# Altium schematic sheet DIGLITE.SchDoc: DigiRig Lite Plus
size A4; Engineer: CT; SheetNumber: 1; SheetTotal: 3
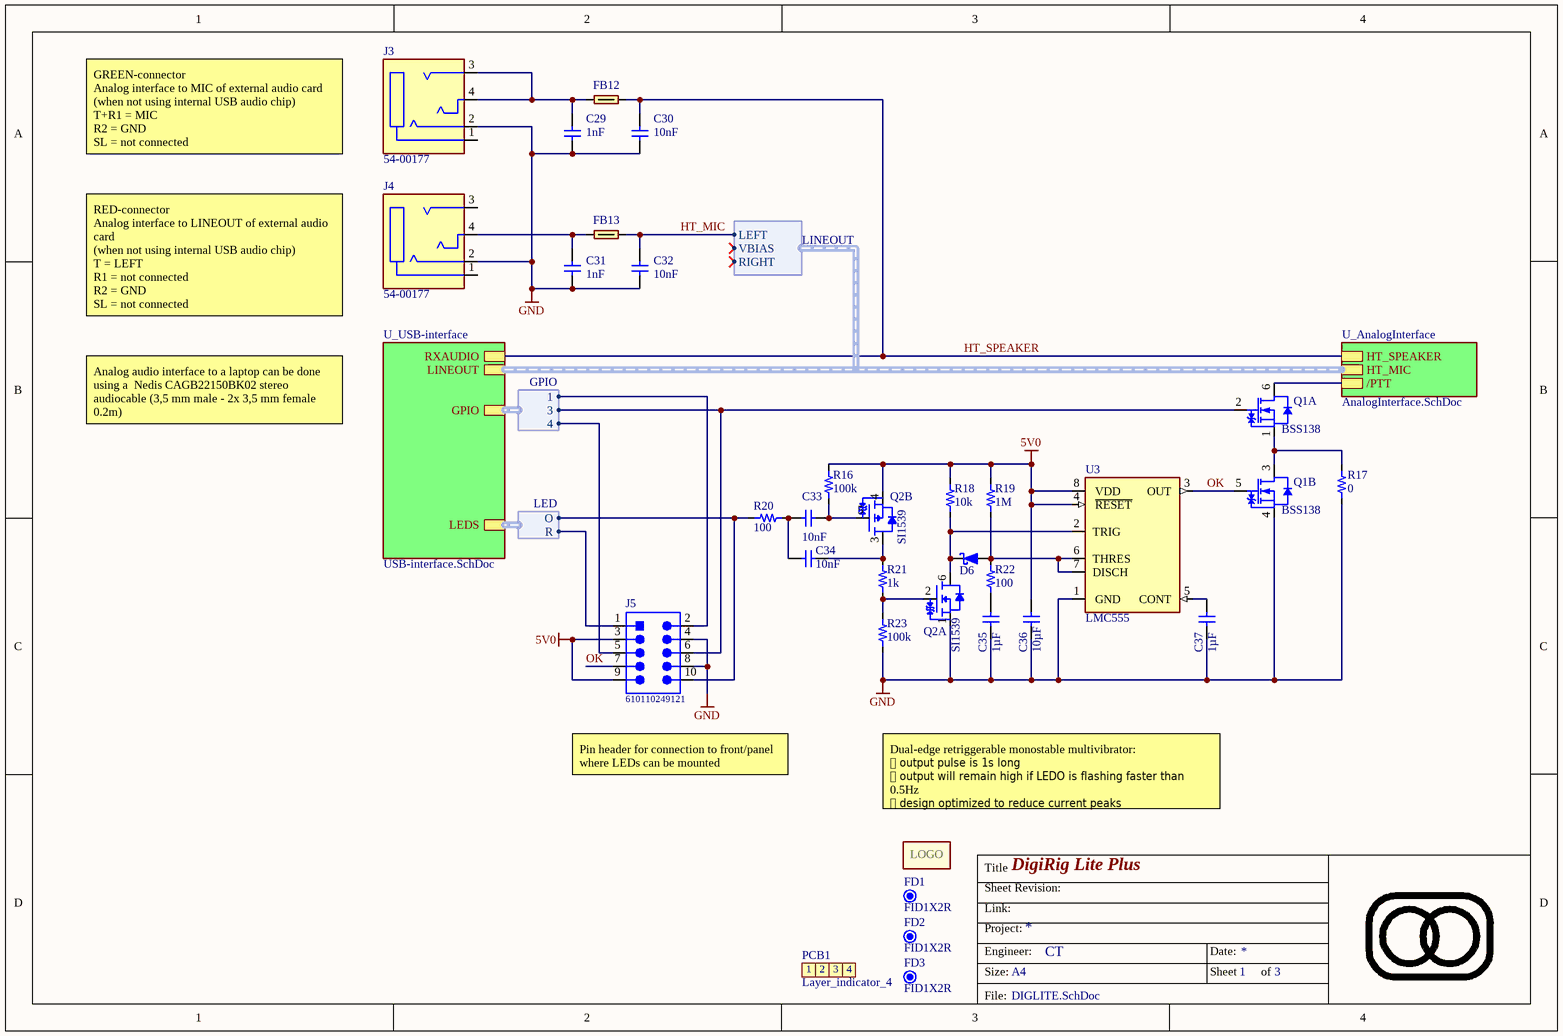
[diagram p0: DIGLITE.SchDoc]

## Parts
C29  value 1nF  [0603-C-N]  (hidden comment: Capacitor 1 nF +/-5% 50V C0G 0603)
C30  value 10nF  [0603-C-N]  (hidden comment: Capacitor 10nF 50V NP0 0603)
C31  value 1nF  [0603-C-N]  (hidden comment: Capacitor 1 nF +/-5% 50V C0G 0603)
C32  value 10nF  [0603-C-N]  (hidden comment: Capacitor 10nF 50V NP0 0603)
C33  value 10nF  [0603-C-N]  (hidden comment: Capacitor 10nF 50V NP0 0603)
C34  value 10nF  [0603-C-N]  (hidden comment: Capacitor 10nF 50V NP0 0603)
C35  value 1µF  [0603-C-N]  (hidden comment: Capacitor 1µF +/-10% 16V X7R 0603)
C36  value 10µF  [WCAP-CSGP_1210_L3.2W2.5H2.5]  (hidden comment: Capacitor 10µF +/-10% 50V X7R 1210)
C37  value 1µF  [0603-C-N]  (hidden comment: Capacitor 1µF +/-10% 16V X7R 0603)
D6  RB521SM-30T2R  [FP-SOD523-MFG]  (value not drawn)
FB12  742792662  [0603-FB-N]  (value not drawn)
FB13  742792662  [0603-FB-N]  (value not drawn)
FD1  FID1X2R  [FID1X2R]  (no BOM)
FD2  FID1X2R  [FID1X2R]  (no BOM)
FD3  FID1X2R  [FID1X2R]  (no BOM)
J3  54-00177  [54-00177-Footprint-1]
J4  54-00177  [54-00177-Footprint-1]
J5  610110249121  [610110249121]
M1  Logo  [LOGO_9x6mm]  (value not drawn)  (no BOM)
PCB1  Layer_indicator_4  [LayerId_4L_4x1.5mm]  (no BOM)
Q1  value BSS138  [SOT-363-N]  (hidden comment: BSS138PS.115)  (parts A,B of 2)
Q2  value SI1539  [SOT-363-N]  (hidden comment: SI1539CDL-T1-GE3)  (parts A,B of 2)
R16  value 100k  [0603-R-N]  (hidden comment: Resistor 100k +/-1% 50V 0603)
R17  value 0  [0603-R-N]  (hidden comment: Jumper 0R <50 mOhm 1A 0603)
R18  value 10k  [0603-R-N]  (hidden comment: Resistor 10k +/-1% 50V 0603)
R19  value 1M  [0603-R-N]  (hidden comment: Resistor 1M +/-1% 50V 0603)
R20  value 100  [0603-R-N]  (hidden comment: Resistor 100R +/-1% 50V 0603)
R21  value 1k  [0603-R-N]  (hidden comment: Resistor 1k +/-1% 50V 0603)
R22  value 100  [0603-R-N]  (hidden comment: Resistor 100R +/-1% 50V 0603)
R23  value 100k  [0603-R-N]  (hidden comment: Resistor 100k +/-1% 50V 0603)
U3  value LMC555  [VSSOP8]  (hidden comment: LMC555CMM/NOPB)

## Sub-sheets
U_AnalogInterface = AnalogInterface.SchDoc: /PTT, HT_SPEAKER, HT_MIC (harness LINEOUT)
U_USB-interface = USB-interface.SchDoc: RXAUDIO, LINEOUT (harness LINEOUT), LEDS (harness LED), GPIO (harness GPIO)

## Harnesses
LED: O, R
GPIO: 1, 3, 4
LINEOUT: LEFT, VBIAS, RIGHT

## Nets
5V0: C36.2 J5.3 J5.9 Q2.4(S) R16.2 R18.2 R19.2 U3.4(~{RESET}) U3.8(VDD)
GND: C29.2 C30.2 C31.2 C32.2 C35.1 C36.1 C37.1 J3.2 J4.2 J5.4 J5.8 Q1.4(S) Q2.1(S) R17.1 R23.1 U3.1(GND)
HT_MIC: C32.1 FB13.2 ; sheet U_USB-interface/LINEOUT.LEFT
HT_SPEAKER: C30.1 FB12.2 ; sheet U_USB-interface/RXAUDIO, sheet U_AnalogInterface/HT_SPEAKER
OK: J5.7 Q1.5(G) U3.3(OUT)
NetC29_1: C29.1 FB12.1 J3.3 J3.4
NetC31_1: C31.1 FB13.1 J4.4
NetC33_1: C33.1 C34.1 R20.1
NetC33_2: C33.2 Q2.5(G) R16.1
NetC34_2: C34.2 Q2.3(D) R21.1
NetC35_2: C35.2 R22.1
NetC37_2: C37.2 U3.5(CONT)
NetD6_1: D6.1(K) Q2.6(D) R18.1 U3.2(TRIG)
NetD6_2: D6.2(A) R19.1 R22.2 U3.6(THRES) U3.7(DISCH)
NetJ5_1: J5.1 ; sheet U_USB-interface/LEDS.R
NetJ5_2: J5.2 ; sheet U_USB-interface/GPIO.1
NetJ5_5: J5.5 ; sheet U_USB-interface/GPIO.4
NetJ5_6: J5.6 Q1.2(G) ; sheet U_USB-interface/GPIO.3
NetJ5_10: J5.10 R20.2 ; sheet U_USB-interface/LEDS.O
NetQ1_1: Q1.1(S) Q1.3(D) R17.2
NetQ1_6: Q1.6(D) ; sheet U_AnalogInterface//PTT
NetQ2_2: Q2.2(G) R21.2 R23.2

Not connected (* = marked no-connect by the designer): J3 1; J4 1 3

## Buses and harness runs
harness sheet U_AnalogInterface/HT_MIC = sheet U_USB-interface/LINEOUT

## Notes on the sheet
- GREEN-connector
  Analog interface to MIC of external audio card
  (when not using internal USB audio chip)
  T+R1 = MIC
  R2 = GND
  SL = not connected
- RED-connector
  Analog interface to LINEOUT of external audio card
  (when not using internal USB audio chip)
  T = LEFT
  R1 = not connected
  R2 = GND
  SL = not connected
- Analog audio interface to a laptop can be done using a  Nedis CAGB22150BK02 stereo audiocable (3,5 mm male - 2x 3,5 mm female 0.2m)
- Pin header for connection to front/panel
  where LEDs can be mounted
- Dual-edge retriggerable monostable multivibrator:
  ⦿ output pulse is 1s long
  ⦿ output will remain high if LEDO is flashing faster than 0.5Hz
  ⦿ design optimized to reduce current peaks
- Title
- Sheet Revision:
- Link:
- Size:
- Project:
- Engineer:
- A4
- Date:
- Sheet
- of
- File:
- (in symbol CMP-000006-6) 1; 2; 3; 4
- (in symbol Logo) LOGO

## Library data of the parts
C29 C31 = CMP-001-00112-14: Capacitor MLCC, General Purpose, size 0603, C0G, 1 nF, +/-5%, 50V; Page Part #: CCQK102T2; Tolerance: 5%; Case/Package: 0603; Width: 0.8mm; Min Operating Temperature: -55°C; Mounting Technology: SMT; Dielectric: C0G; Packaging: Cut Tape; Max Operating Temperature: 125°C; Voltage Rating: 50V; Height: 0.8mm; Length: 1.6mm; JLCPCB Part #: C340644; REACH SVHC: Unknown; Capacitor Type: MLCC; Usage: General Purpose; Pins: 2
C30 C32-C34 = CMP-001-00137-7: Multilayer Ceramic Capacitor, Grm Series, 0.01 F, 5%, C0g / Np0, 50 V, 0603 [1608 Metric]; FLIR Part #: YCAM10N-7; Page Part #: CCQJ103T; Temperature Coefficient: 30ppm/°C; Reach SVHC Compliant: No; Case/Package: 0603; Thickness: 0.035inch; Width: 0.8mm; Case Code (Metric): 1608; Termination: SMD/SMT; Min Operating Temperature: -55°C; Voltage Rating (DC): 50V; Mounting Technology: Surface Mount; Package Quantity: 4000; Depth: 0.8mm; Dielectric: C0G; Packaging: Cut Tape; Voltage: 50V; Max Operating Temperature: 125°C; RoHS Compliant: Yes; Material: Ceramic; Lead Pitch: 0.5mm; Case Code (Imperial): 0603; Tolerance: 5%; Voltage Rating: 50V; Lead Free: Lead Free; Height: 0.8mm; Length: 1.6mm; JLCPCB Part #: C85973; Series: GRM
C35 C37 = CMP-001-00004-22: Capacitor MLCC, General Purpose, size 0603, X7R, 1µF, +/-10%, 16V; Tolerance: 10%; Mounting Technology: SMT; Usage: General Purpose; Case/Package: 0603; Max Operating Temperature: 125°C; JLCPCB Part #: C15849; Dielectric: X7R; RoHS Compliant: True; Height: 0.8mm; Width: 0.8mm; Capacitor Type: MLCC; Voltage Rating: 16V; Length: 1.6mm; Pins: 2; Min Operating Temperature: -55°C
C36 = CMP-072-000922-16: WCAP-CSGP Multilayer Ceramic Chip Capacitor, General Purpose, size 1210, X7R, 10µF, 50VDC; Tolerance: 10%; Technical Reference: X7R1210106K050DFCT10000; Insulation Resistance: 0.01GO; Capacitor Type: MLCC; ComponentLink2URL: https://www.we-online.com/redexpert/spec/885012209073?ad; ComponentLink1URL: https://www.we-online.com/redexpert/article/885012209073?ad; Source: WCAP-CSGP.SchLib; Case/Package: 1210; Packaging: Tape and Reel; ComponentLink1Description: Website Link; Pins: 2; Width: 2.5mm; Voltage Rating: 50V; ComponentLink2Description: Datasheet Link; Match Code: WCAP-CSGP; Max Operating Temperature: 125°C; Usage: General Purpose; JLCPCB Part #: C77102; Height: 2.5mm; Dielectric: X7R; Dissipation Factor: 10%; Length: 3.2mm; Min Operating Temperature: -55°C; Design Item ID: 885012209073; Mounting Technology: SMT
D6 = CMP-004-00062-1: RB521SM Series 30 V 200 mA Surface Mount Schottky Barrier Diode -SOD-523 (SC-79); Forward Voltage: 470mV; Forward Current: 200mA; Max Repetitive Reverse Voltage (Vrrm): 30V; Max Forward Surge Current (Ifsm): 1A; Element Configuration: Single; Number of Elements: 1; Peak Reverse Current: 30µA; JLCPCB Part #: C727120; Case/Package: SOD-523-2; Packaging: Tape & Reel; Radiation Hardening: No; Max Reverse Voltage (DC): 30V; Width: 800µm; Number of Terminals: 2; Min Operating Temperature: -40°C; Average Rectified Current: 200mA; REACH SVHC: Yes; Max Operating Temperature: 150°C; RoHS: Compliant; Pins: 2; Length: 1.2mm; Peak Non-Repetitive Surge Current: 1A; Lead Free: Lead Free; Reverse Standoff Voltage: 30V; Mounting Technology: Surface Mount; Max Output current: 200mA; Height: 600µm; Lifecycle Status: Production; Weight: 992.233309µg
FB12 FB13 = CMP-066-000126-8: WE-CBF SMT EMI Suppression Ferrite Bead, size 0603, 1000O, 0.83A; Manufacturer: Wurth Elektronik; Page Part #: FILTER279; Case/Size Code: 0603; Impedance Max Test Condition: 120MHz; Type: Wide Band; DC Resistance Max: 0.3O; Impedance Max: 1050O; Rated Current: 0.6A; Mount: Surface Mount; Impedance @100MHz: 1000O; JLCPCB Part #: C180490; ComponentLink1URL: https://www.we-online.com/redexpert/article/742792662?ad; ComponentLink2URL: https://www.we-online.com/redexpert/spec/742792662?ad; Length: 1.6mm; ComponentLink1Description: Website Link; Manufacturer Part Number: 742792662; Width: 0.8mm; Match Code: WE-CBF; Component Type: Standard; Design Item ID: 742792662; Pin Count: 2; Operating Temperature Max: 125°C; Packaging: Tape and Reel; ComponentLink2Description: Datasheet Link; Operating Temperature Min: -55°C; Category: Ferrites for PCB Assembly; Height: 0.8mm
FD1-FD3 = CMP-00028-00005-14: Fiducial - Round 1x2mm; Pins: 0
J3 J4 = CMP-002-00136-2: Conn Jack 4 Cond 3.5MM SMD R/a; Shielding: Shielded; Body Color: Black; Gender: Female; Min Operating Temperature: -40°C; Termination: Solder; Mounting Technology: Surface Mount; JLCPCB Part #: C7507452; Max Operating Temperature: 105°C; Contact Plating: Gold; Contact Material: Bronze; Series: -
J5 = CMP-045-000083-5: WR-PHD Pin Header, SMT, pitch 2.54mm, Dual Row, Angled, 10p; Manufacturer: Wurth Elektronik; Rated Current: 3A; Working Voltage: 250VAC; Contact Resistance: 20mOhm; Pin Number: 10; Withstanding Voltage: 600VAC; Component Type: Standard; Packaging: Tape and Reel; ComponentLink1Description: Manufacturer; Operating Temperature: -40 to +105degC; ComponentLink1URL: http://www.we-online.de; Source: WR-PHD_Pin Header.SchLib; Design Item ID: 610110249121; Pitch: 2.54mm; ComponentLink2Description: Datasheet; ComponentLink2URL: https://www.we-online.com/catalog/datasheet/610110249121.pdf; Gender: Pin Header; Orientation: Angled; Row Number: Dual; Pin Count: 10; Manufacturer Part Number: 610110249121; Mounting Technology: SMT; JLCPCB Part #: C5149355
PCB1 = CMP-000006-6: Layer indicator for 4 layers
Q1 = CMP-013-00062-13: Transistor MOSFET Array Dual N-CH 60V 320mA 6-Pin TSSOP T/R; Page Part #: TBSS138PS; Transistor Type: NMOS, NMOS; Fall Time: 4ns; Input Capacitance: 50pF; Turn-On Delay Time: 2ns; Turn-Off Delay Time: 9ns; Gate to Source Voltage (Vgs): 20V; Power Dissipation: 280mW; Threshold Voltage: 1.2V; Rds On Max: 1.6R; Max Power Dissipation: 420mW; Rise Time: 3ns; Max Operating Temperature: 150°C; Drain to Source Voltage (Vdss): 60V; Max Dual Supply Voltage: 60V; JLCPCB Part #: C154900; Drain to Source Breakdown Voltage: 60V; Contact Plating: Tin; Min Operating Temperature: -55°C; Packaging: Tape and Reel; Case/Package: SOT-363; Continuous Drain Current (ID): 320mA; Radiation Hardening: No; Lead Free: Lead Free; RoHS Compliant: Yes; Drain to Source Resistance: 1.6R; Reach SVHC Compliant: Yes; Pins: 6
Q2 = CMP-142-000016-6: Trans Mosfet N/p-ch 30V 0.7A/0.4A 6-PIN SC-70 T/r / Mosfet N/p-ch 30V SOT363; Turn-On Delay Time: 32ns; Rise Time: 19ns; FET Type: N and P-Channel; Max Power Dissipation: 340mW; Drain to Source Resistance: 740mR; Threshold Voltage: 1.2V; Polarity: N-CHANNEL,P-CHANNEL; Continuous Drain Current (ID): 700mA; Rds On Max: 388mR; Fall Time: 10ns; Gate to Source Voltage (Vgs): 20V; Number of Channels: 2; Input Capacitance: 28pF; Turn-Off Delay Time: 4ns; Transistor Type: CMOS; Drain to Source Voltage (Vdss): 30V; JLCPCB Part #: C141530; Lead Free: Lead Free; Pins: 6; Series: TrenchFET®; Radiation Hardening: No; Case/Package: SOT-363; Packaging: Tape and Reel; Reach SVHC Compliant: No; Min Operating Temperature: -55°C; Weight: 0.000988oz; Mounting Technology: Surface Mount; Package Quantity: 3000; Max Operating Temperature: 150°C; RoHS Compliant: Yes
R16 R23 = CMP-009-00023-29: Chip Resistor, Thick Film, General Purpose, 0603, 100mW, 50V, 100 kOhm, +/-1%; Page Part #: ROQF1003; Tolerance: 1%; Elements: 1; Max Operating Temperature: 155°C; Usage: General Purpose; Mounting Technology: SMT; Voltage Rating: 50V; Power Rating: 100mW; Min Operating Temperature: -55°C; RoHS Compliant: Yes; Pins: 2; Resistor Type: Thick Film; JLCPCB Part #: C25803; Case/Package: 0603; JLCPCB Basic part: Yes
R17 = CMP-009-00006-27: Chip Jumper, Thick Film, Jumper, 0603, 100mW, 1A, 0 Ohm, <50 mOhm; FLIR Part #: YRES0E-1; Page Part #: ROQJ0000; Elements: 1; Tolerance: 50 mOhm; Voltage Rating: 75V; Min Operating Temperature: -55°C; RoHS Compliant: True; Usage: Jumper; Mounting Technology: SMT; Max Operating Temperature: 155°C; Case/Package: 0603; JLCPCB Part #: C21189; Current Rating: 1A; Resistor Type: Thick Film; Power Rating: 100mW; Pins: 2; JLCPCB Basic Part: Yes
R18 = CMP-009-00017-29: Chip Resistor, Thick Film, General Purpose, 0603, 100mW, 50V, 10 kOhm, +/-1%; FLIR Part #: YRES10K-1; Page Part #: ROQF1002; Elements: 1; Tolerance: 1%; Pins: 2; Resistor Type: Thick Film; Voltage Rating: 50V; Power Rating: 100mW; Mounting Technology: SMT; Min Operating Temperature: -55°C; Case/Package: 0603; RoHS Compliant: Yes; Usage: General Purpose; JLCPCB Part #: C25804; Max Operating Temperature: 155°C; JLCPCB Basic part: Yes
R19 = CMP-009-00234-18: Chip Resistor, Thick Film, General Purpose, 0603, 100mW, 50V, 1 MOhm, +/-1%; Tolerance: 1%; Elements: 1; RoHS Compliant: Yes; Mounting Technology: SMT; Max Operating Temperature: 155°C; Resistor Type: Thick Film; Usage: General Purpose; Voltage Rating: 50V; Min Operating Temperature: -55°C; Power Rating: 100mW; JLCPCB Part #: C22935; Pins: 2; Case/Package: 0603; JLCPCB Basic Part: Yes
R20 R22 = CMP-009-00232-18: Chip Resistor, Thick Film, General Purpose, 0603, 63mW, 50V, 100 Ohm, +/-1%; Page Part #: ROQF1000; Temperature Coefficient: 100ppm/°C; Power Rating: 100mW; Elements: 1; Tolerance: 1%; Resistor Type: Thick Film; Usage: General Purpose; Voltage Rating: 50V; RoHS Compliant: Yes; JLCPCB Part #: C22775; Mounting Technology: SMT; Case/Package: 0603; Max Operating Temperature: 155°C; Pins: 2; Min Operating Temperature: -55°C
R21 = CMP-009-00014-30: Chip Resistor, Thick Film, General Purpose, 0603, 100mW, 50V, 1 kOhm, +/-1%; FLIR Part #: YRES1K-1; Page Part #: ROQF1001; Tolerance: 1%; Elements: 1; JLCPCB Part #: C21190; Pins: 2; Resistor Type: Thick Film; RoHS Compliant: Yes; Case/Package: 0603; Min Operating Temperature: -55°C; Power Rating: 100mW; Mounting Technology: SMT; Usage: General Purpose; Max Operating Temperature: 155°C; Voltage Rating: 50V; JLCPCB Basic Part: Yes
U3 = CMP-023-00008-3: World’s smallest 555 timer with low power, high accuracy and a Fmax of 3MHz 8-VSSOP -40 to 85; Propagation Delay: 100ns; Min Supply Voltage: 1.5V; Number of Timers/Counters: 1; Current Rating: 150A; Max Supply Voltage: 15V; Output Current: 100mA; Power Dissipation: 555mW; Supply Current: 50uA; Operating Supply Current: 150uA; Low Level Output Current: 50mA; Quiescent Current: 400uA; High Level Output Current: -10mA; Height: 0.86mm; Packaging: Tape and Reel; Min Operating Temperature: -40°C; Width: 3mm; Package Quantity: 1000; Turn-On Delay Time: 100ns; Reach SVHC Compliant: No; Frequency: 3MHz; Lead Free: Lead Free; Case/Package: MSOP; RoHS Compliant: Yes; Radiation Hardening: No; Max Power Dissipation: 555mW; JLCPCB Part #: C5160090; Pins: 8; Series: -; Thickness: 970um; Mounting Technology: Surface Mount; Length: 3mm; Max Operating Temperature: 125°C; Number of Channels: 1